# Altium schematic sheet USB_HUB.SchDoc
size A4; SheetNumber: 3; SheetTotal: 3
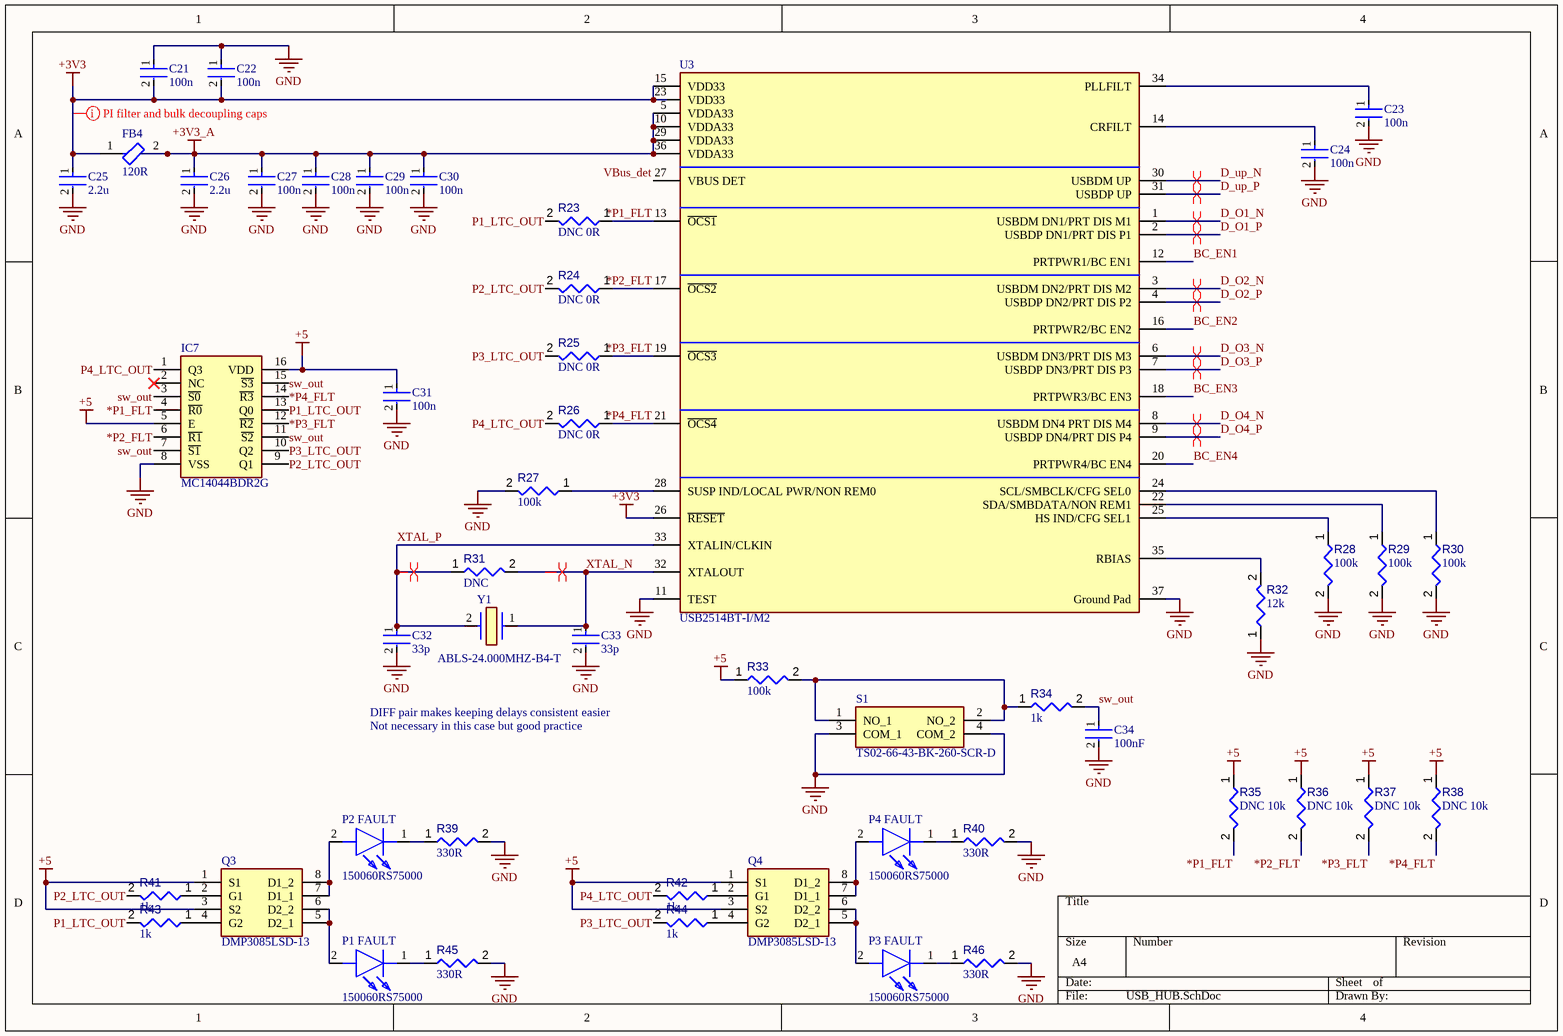
[diagram p0: USB_HUB.SchDoc]

## Parts
C21  Capacitance: 100n  [0603-C]  (hidden comment: 0603 CAP)
C22  Capacitance: 100n  [0603-C]  (hidden comment: 0603 CAP)
C23  Capacitance: 100n  [0603-C]  (hidden comment: 0603 CAP)
C24  Capacitance: 100n  [0603-C]  (hidden comment: 0603 CAP)
C25  Capacitance: 2.2u  [0603-C]  (hidden comment: 0603 CAP)
C26  Capacitance: 2.2u  [0603-C]  (hidden comment: 0603 CAP)
C27  Capacitance: 100n  [0603-C]  (hidden comment: 0603 CAP)
C28  Capacitance: 100n  [0603-C]  (hidden comment: 0603 CAP)
C29  Capacitance: 100n  [0603-C]  (hidden comment: 0603 CAP)
C30  Capacitance: 100n  [0603-C]  (hidden comment: 0603 CAP)
C31  Capacitance: 100n  [0603-C]  (hidden comment: 0603 CAP)
C32  Capacitance: 33p  [0603-C]  (hidden comment: 0603 CAP)
C33  Capacitance: 33p  [0603-C]  (hidden comment: 0603 CAP)
C34  100nF  [FP-GRM188-0_1-e0_2_0_55-IPC_A]
FB4  120R  [FP-ILHB-0805-IPC_C]
IC7  MC14044BDR2G  [SOIC127P600X175-16N]
P1_FAULT  150060RS75000  [LEDC1608X80N]
P2_FAULT  150060RS75000  [LEDC1608X80N]
P3_FAULT  150060RS75000  [LEDC1608X80N]
P4_FAULT  150060RS75000  [LEDC1608X80N]
Q3  DMP3085LSD-13  [SOIC127P600X175-8N]
Q4  DMP3085LSD-13  [SOIC127P600X175-8N]
R23  value DNC 0R  [0603-R]  (hidden comment: 0603 Resistor)
R24  value DNC 0R  [0603-R]  (hidden comment: 0603 Resistor)
R25  value DNC 0R  [0603-R]  (hidden comment: 0603 Resistor)
R26  value DNC 0R  [0603-R]  (hidden comment: 0603 Resistor)
R27  value 100k  [0603-R]  (hidden comment: 0603 Resistor)
R28  value 100k  [0603-R]  (hidden comment: 0603 Resistor)
R29  value 100k  [0603-R]  (hidden comment: 0603 Resistor)
R30  value 100k  [0603-R]  (hidden comment: 0603 Resistor)
R31  value DNC  [0603-R]  (hidden comment: 0603 Resistor)
R32  value 12k  [0603-R]  (hidden comment: 0603 Resistor)
R33  value 100k  [0603-R]  (hidden comment: 0603 Resistor)
R34  value 1k  [0603-R]  (hidden comment: 0603 Resistor)
R35  value DNC 10k  [0603-R]  (hidden comment: 0603 Resistor)
R36  value DNC 10k  [0603-R]  (hidden comment: 0603 Resistor)
R37  value DNC 10k  [0603-R]  (hidden comment: 0603 Resistor)
R38  value DNC 10k  [0603-R]  (hidden comment: 0603 Resistor)
R39  value 330R  [0603-R]  (hidden comment: 0603 Resistor)
R40  value 330R  [0603-R]  (hidden comment: 0603 Resistor)
R41  value 1k  [0603-R]  (hidden comment: 0603 Resistor)
R42  value 1k  [0603-R]  (hidden comment: 0603 Resistor)
R43  value 1k  [0603-R]  (hidden comment: 0603 Resistor)
R44  value 1k  [0603-R]  (hidden comment: 0603 Resistor)
R45  value 330R  [0603-R]  (hidden comment: 0603 Resistor)
R46  value 330R  [0603-R]  (hidden comment: 0603 Resistor)
S1  TS02-66-43-BK-260-SCR-D  [TS026643BK260SCRD]
U3  USB2514BT-I/M2  [FP-36SQFN-3706-6x6B-MFG]
Y1  ABLS-24.000MHZ-B4-T  [ABLS24000MHZB4T]

## Nets
+3V3: C21.2 C22.2 C25.1 FB4.1 U3.15(VDD33) U3.23(VDD33) U3.26(~{RESET})
+3V3_A: C26.1 C27.1 C28.1 C29.1 C30.1 FB4.2 U3.5(VDDA33) U3.10(VDDA33) U3.29(VDDA33) U3.36(VDDA33)
+5: C31.1 IC7.5(E) IC7.16(VDD) Q3.1(S1) Q3.3(S2) Q4.1(S1) Q4.3(S2) R33.1 R35.1 R36.1 R37.1 R38.1
GND: C21.1 C22.1 C23.2 C24.2 C25.2 C26.2 C27.2 C28.2 C29.2 C30.2 C31.2 C32.2 C33.2 C34.2 IC7.8(VSS) R27.2 R28.2 R29.2 R30.2 R32.1 R39.2 R40.2 R45.2 R46.2 S1.3(COM_1) S1.4(COM_2) U3.11(TEST) U3.37(Ground_Pad)
*P1_FLT: IC7.4(~{R0}) R23.1 R35.2 U3.13(~{OCS1})
*P2_FLT: IC7.6(~{R1}) R24.1 R36.2 U3.17(~{OCS2})
*P3_FLT: IC7.12(~{R2}) R25.1 R37.2 U3.19(~{OCS3})
*P4_FLT: IC7.14(~{R3}) R26.1 R38.2 U3.21(~{OCS4})
BC_EN1: U3.12(PRTPWR1/BC_EN1)
BC_EN2: U3.16(PRTPWR2/BC_EN2)
BC_EN3: U3.18(PRTPWR3/BC_EN3)
BC_EN4: U3.20(PRTPWR4/BC_EN4)
D_O1_N: U3.1(USBDM_DN1/PRT_DIS_M1)
D_O1_P: U3.2(USBDP_DN1/PRT_DIS_P1)
D_O2_N: U3.3(USBDM_DN2/PRT_DIS_M2)
D_O2_P: U3.4(USBDP_DN2/PRT_DIS_P2)
D_O3_N: U3.6(USBDM_DN3/PRT_DIS_M3)
D_O3_P: U3.7(USBDP_DN3/PRT_DIS_P3)
D_O4_N: U3.8(USBDM_DN4_PRT_DIS_M4)
D_O4_P: U3.9(USBDP_DN4/PRT_DIS_P4)
D_up_N: U3.30(USBDM_UP)
D_up_P: U3.31(USBDP_UP)
P1_LTC_OUT: IC7.13(Q0) R23.2 R43.2
P2_LTC_OUT: IC7.9(Q1) R24.2 R41.2
P3_LTC_OUT: IC7.10(Q2) R25.2 R44.2
P4_LTC_OUT: IC7.1(Q3) R26.2 R42.2
sw_out: C34.1 IC7.3(~{S0}) IC7.7(~{S1}) IC7.11(~{S2}) IC7.15(~{S3}) R34.2
VBus_det: U3.27(VBUS_DET)
XTAL_N: C33.1 R31.2 U3.32(XTALOUT) Y1.1(CRYSTAL_1)
XTAL_P: C32.1 R31.1 U3.33(XTALIN/CLKIN) Y1.2(CRYSTAL_2)
NetC23_1: C23.1 U3.34(PLLFILT)
NetC24_1: C24.1 U3.14(CRFILT)
NetP1_FAULT_1: P1_FAULT.1(K) R45.1
NetP1_FAULT_2: P1_FAULT.2(A) Q3.5(D2_1) Q3.6(D2_2)
NetP2_FAULT_1: P2_FAULT.1(K) R39.1
NetP2_FAULT_2: P2_FAULT.2(A) Q3.7(D1_1) Q3.8(D1_2)
NetP3_FAULT_1: P3_FAULT.1(K) R46.1
NetP3_FAULT_2: P3_FAULT.2(A) Q4.5(D2_1) Q4.6(D2_2)
NetP4_FAULT_1: P4_FAULT.1(K) R40.1
NetP4_FAULT_2: P4_FAULT.2(A) Q4.7(D1_1) Q4.8(D1_2)
NetQ3_2: Q3.2(G1) R41.1
NetQ3_4: Q3.4(G2) R43.1
NetQ4_2: Q4.2(G1) R42.1
NetQ4_4: Q4.4(G2) R44.1
NetR27_1: R27.1 U3.28(SUSP_IND/LOCAL_PWR/NON_REM0)
NetR28_1: R28.1 U3.25(HS_IND/CFG_SEL1)
NetR29_1: R29.1 U3.22(SDA/SMBDATA/NON_REM1)
NetR30_1: R30.1 U3.24(SCL/SMBCLK/CFG_SEL0)
NetR32_2: R32.2 U3.35(RBIAS)
NetR33_2: R33.2 R34.1 S1.1(NO_1) S1.2(NO_2)

Not connected (* = marked no-connect by the designer): IC7 2(NC)*

## Layout directives
differential pair: D_O1_N, D_O1_P, D_O2_N, D_O2_P, D_O3_N, D_O3_P, D_O4_N, D_O4_P, D_up_N, D_up_P, XTAL_N, XTAL_P
mark named PI filter and bulk decoupling caps: +3V3

## Notes on the sheet
- DIFF pair makes keeping delays consistent easier
- Not necessary in this case but good practice

## Library data of the parts
C21-C33 = CMP-2006-02792-2: Manufacturer: Murata; Manufacturer Part Number: GRM188R60J106ME47D; Voltage Rating (DC): 6.3V; Dielectric: X5R; Material: Ceramic; Tolerance: 20%; Packaging: Tape and Reel; Width: 0.031inch; Termination: SMD/SMT; Package Quantity: 4000; Voltage Rating: 6.3V; Case/Package: 0603; Min Operating Temperature: -55°C; Voltage: 6.3V; Length: 1.6mm; Thickness: 0.035inch; Lead Free: Lead Free; Depth: 0.8mm; Case Code (Imperial): 0603; Max Operating Temperature: 85°C; Height: 0.8mm; Mount: Surface Mount; REACH SVHC: No SVHC; Radiation Hardening: No; Case Code (Metric): 1608
C34 = CMP-2006-02792-2: Chip Multilayer Ceramic Capacitors for General Purpose, 0603, 10uF, X5R, 15%, 20%, 6.3V; Packaging: Tape and Reel; Voltage Rating (DC): 6.3V; Width: 0.031inch; Termination: SMD/SMT; Dielectric: X5R; Package Quantity: 4000; Voltage Rating: 6.3V; Capacitance: 10uF; Case/Package: 0603; Min Operating Temperature: -55°C; Voltage: 6.3V; Length: 1.6mm; Thickness: 0.035inch; Lead Free: Lead Free; Depth: 0.8mm; Case Code (Imperial): 0603; Max Operating Temperature: 85°C; Material: Ceramic; Height: 0.8mm; Tolerance: 20%; Mount: Surface Mount; REACH SVHC: No SVHC; Radiation Hardening: No; Case Code (Metric): 1608
FB4 = CMP-02428-000001-1: FERRITE BEAD 600 OHM 0805 1LN; Manufacturer: Vishay; Manufacturer Part Number: ILHB0805ER601V; Tolerance: 25%; Shielding: true; Test Frequency: 100MHz; Impedance At Frequency: 600Ω @ 100MHz; Series Resistance: 0.1Ω; Rms Current: 2000mA; ComponentLink2URL: http://www.vishay.com/docs/34102/ilhb.pdf; Octopart: https://octopart.com/ilhb0805er601v-vishay-39650184; Automotive: No; Height: 1.1mm; Mouser Description: Ferrite Beads Multi-Layer High Current 600Ohm 25% 100MHz 2A 100mOhm DCR 0805 T/R; ComponentLink2Description: Datasheet; Device Class L2: EMI / RFI Components; Lead Free: Yes; Ipc Land Pattern Name: CAPC200125X90; Package: ILHB-0805; Device Class L1: Passive Components; Digikey Description: FERRITE BEAD 600 OHM 0805 1LN; Category: FBead; Temperature Range High: +125°C; Temperature: -55°C to +125°C; RoHS: TRUE; Temperature Range Low: -55°C; Device Class L3: Ferrite Beads and Chips
IC7 = MC14044BDR2G: Integrated Circuit; Manufacturer_Name: onsemi; Datasheet Link: http://www.onsemi.com/pub/Collateral/MC14043B-D.PDF; Height: 1.75mm; Manufacturer_Part_Number: MC14044BDR2G; Mouser Part Number: 863-MC14044BDR2G; Mouser Price/Stock: https://www.mouser.co.uk/ProductDetail/onsemi/MC14044BDR2G?qs=g2rIOKKlpobsE42k0bnUHA%3D%3D; Arrow Part Number: MC14044BDR2G; Arrow Price/Stock: http://www.arrow.com/en/products/mc14044bdr2g/on-semiconductor
P1_FAULT P2_FAULT P3_FAULT P4_FAULT = 150060RS75000: LED; Manufacturer_Name: Wurth Elektronik; Datasheet Link: http://katalog.we-online.de/led/datasheet/150060RS75000.pdf; Height: 0.8mm; Manufacturer_Part_Number: 150060RS75000; Mouser Part Number: 710-150060RS75000; Mouser Price/Stock: https://www.mouser.co.uk/ProductDetail/Wurth-Elektronik/150060RS75000?qs=LlUlMxKIyB3QnmZ3fw%2FVCA%3D%3D
Q3 Q4 = DMP3085LSD-13: MOSFET (P-Channel); Manufacturer_Name: Diodes Inc.; Datasheet Link: https://www.diodes.com/assets/Datasheets/DMP3085LSD.pdf; Height: 1.75mm; Manufacturer_Part_Number: DMP3085LSD-13; Mouser Part Number: 621-DMP3085LSD-13; Mouser Price/Stock: https://www.mouser.co.uk/ProductDetail/Diodes-Incorporated/DMP3085LSD-13?qs=L1DZKBg7t5H5rh%252BaQZmdng%3D%3D; Arrow Part Number: DMP3085LSD-13; Arrow Price/Stock: https://www.arrow.com/en/products/dmp3085lsd-13/diodes-incorporated?region=nac
R23-R31 R33-R46 = CMP-009-00014-5: Manufacturer: Yageo; Manufacturer Part Number: RC0603FR-071KL; Manufacturer: Panasonic; Manufacturer Part Number: ERJ3EKF1001V; Manufacturer Part Number: RC0603FR-131KL; Voltage Rating: 50V; Power: 100mW; Tolerance: 1%; Mounting Technology: SM; Pins: 2; Case/Package: 0603; Min Operating Temperature: -55°C; RoHS Compliant: True; Max Operating Temperature: 155°C; Component Type: Resistors
R32 = CMP-009-00014-5: 0603 Resistor +-1%; Manufacturer: Yageo; Manufacturer Part Number: RC0603FR-071KL; Manufacturer: Panasonic; Manufacturer Part Number: ERJ3EKF1001V; Manufacturer Part Number: RC0603FR-131KL; Voltage Rating: 50V; Power: 100mW; Tolerance: 1%; Mounting Technology: SM; Pins: 2; Case/Package: 0603; Min Operating Temperature: -55°C; RoHS Compliant: True; Max Operating Temperature: 155°C; Component Type: Resistors
S1 = TS02-66-43-BK-260-SCR-D: Switch; Manufacturer_Name: CUI Inc.; Datasheet Link: https://www.arrow.com/en/products/ts02-66-43-bk-260-scr-d/cui-devices?region=nac; Height: 4.5mm; Manufacturer_Part_Number: TS02-66-43-BK-260-SCR-D; Mouser Part Number: 179-TS026643BK260SCR; Mouser Price/Stock: https://www.mouser.co.uk/ProductDetail/CUI-Devices/TS02-66-43-BK-260-SCR-D?qs=A6eO%252BMLsxmStfetPfb1PWw%3D%3D; Arrow Part Number: TS02-66-43-BK-260-SCR-D; Arrow Price/Stock: https://www.arrow.com/en/products/ts02-66-43-bk-260-scr-d/cui-devices?region=nac
U3 = CMP-06284-000022-1: IC HUB CTLR 4PORT USB 2.0 HS 36S; Operating Supply Current: 70mA; Lead Free: Lead Free; Packaging: Tape and Reel; Interface: USB; Number of Pins: 36; Min Operating Temperature: -40°C; Max Operating Temperature: 85°C; RoHS Compliant: Yes
Y1 = ABLS-24.000MHZ-B4-T: Crystal or Oscillator; Manufacturer_Name: ABRACON; Datasheet Link: https://abracon.com/Support/PackageDrawing/Resonators/ABLS-2D.pdf; Height: 4.2mm; Manufacturer_Part_Number: ABLS-24.000MHZ-B4-T; Mouser Part Number: 815-ABLS-24.0M-T; Mouser Price/Stock: https://www.mouser.co.uk/ProductDetail/ABRACON/ABLS-24000MHZ-B4-T?qs=yTU0IcKoRlFmg5ISZhZAjw%3D%3D; Arrow Part Number: ABLS-24.000MHZ-B4-T; Arrow Price/Stock: https://www.arrow.com/en/products/abls-24.000mhz-b4-t/abracon